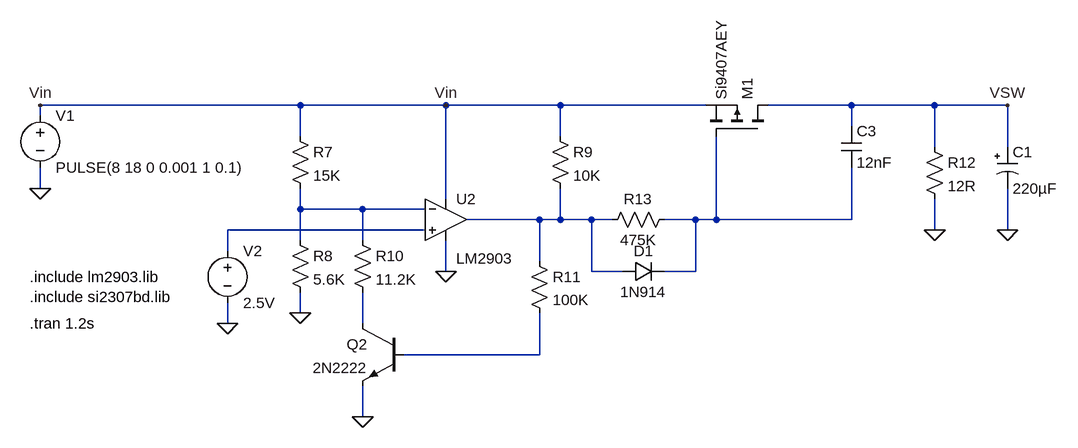
[diagram p0: schematic Power detection-1.asc]
Power detection-1.asc, the LTspice schematic file:
Version 4
SHEET 1 1060 1260
WIRE -432 608 -832 608
WIRE -208 608 -432 608
WIRE -32 608 -208 608
WIRE 192 608 -32 608
WIRE 416 608 288 608
WIRE 544 608 416 608
WIRE 656 608 544 608
WIRE -832 624 -832 608
WIRE 416 640 416 608
WIRE -432 656 -432 608
WIRE -32 656 -32 608
WIRE 544 672 544 608
WIRE 656 672 656 608
WIRE -832 736 -832 704
WIRE -208 752 -208 608
WIRE -432 768 -432 736
WIRE -336 768 -432 768
WIRE -240 768 -336 768
WIRE -64 784 -176 784
WIRE -32 784 -32 736
WIRE -32 784 -64 784
WIRE 16 784 -32 784
WIRE 48 784 16 784
WIRE 176 784 128 784
WIRE 208 784 208 656
WIRE 208 784 176 784
WIRE 416 784 416 704
WIRE 416 784 208 784
WIRE -240 800 -544 800
WIRE 544 800 544 752
WIRE 656 800 656 736
WIRE -432 816 -432 768
WIRE -336 816 -336 768
WIRE -544 832 -544 800
WIRE -64 848 -64 784
WIRE -208 864 -208 816
WIRE 16 864 16 784
WIRE 64 864 16 864
WIRE 176 864 176 784
WIRE 176 864 128 864
WIRE -432 928 -432 896
WIRE -544 944 -544 912
WIRE -336 944 -336 896
WIRE -64 992 -64 928
WIRE -64 992 -272 992
WIRE -336 1088 -336 1040
FLAG -832 736 0
FLAG -832 608 Vin
FLAG -208 864 0
FLAG -208 608 Vin
FLAG -432 928 0
FLAG -336 1088 0
FLAG 544 800 0
FLAG 656 800 0
FLAG 656 608 VSW
FLAG -544 944 0
SYMBOL voltage -832 608 R0
WINDOW 123 0 0 Left 0
WINDOW 39 0 0 Left 0
SYMATTR InstName V1
SYMATTR Value PULSE(8 18 0 0.001 1 0.1)
SYMBOL Opamps\\opamp2 -208 720 R0
WINDOW 3 16 96 Invisible 0
WINDOW 38 16 124 Left 0
SYMATTR Value ""
SYMATTR SpiceModel LM2903
SYMATTR InstName U2
SYMBOL res -448 640 R0
SYMATTR InstName R7
SYMATTR Value 15K
SYMBOL res -448 800 R0
SYMATTR InstName R8
SYMATTR Value 5.6K
SYMBOL res -48 640 R0
SYMATTR InstName R9
SYMATTR Value 10K
SYMBOL res -352 800 R0
SYMATTR InstName R10
SYMATTR Value 11.2K
SYMBOL res 528 656 R0
SYMATTR InstName R12
SYMATTR Value 12R
SYMBOL polcap 640 672 R0
WINDOW 3 24 64 Left 0
SYMATTR Value 220µF
SYMATTR InstName C1
SYMATTR Description Capacitor
SYMATTR Type cap
SYMATTR SpiceLine V=25 Irms=750m Rser=0.16 Lser=0
SYMBOL cap 400 640 R0
SYMATTR InstName C3
SYMATTR Value 12nF
SYMBOL npn -272 944 M0
SYMATTR InstName Q2
SYMATTR Value 2N2222
SYMBOL res -80 832 R0
SYMATTR InstName R11
SYMATTR Value 100K
SYMBOL res 144 768 R90
WINDOW 0 0 56 VBottom 0
WINDOW 3 32 56 VTop 0
SYMATTR InstName R13
SYMATTR Value 475K
SYMBOL voltage -544 816 R0
WINDOW 123 0 0 Left 0
WINDOW 39 0 0 Left 0
SYMATTR InstName V2
SYMATTR Value 2.5V
SYMBOL pmos 288 656 M270
SYMATTR InstName M1
SYMATTR Value Si9407AEY
SYMBOL diode 64 880 R270
WINDOW 0 32 32 VTop 0
WINDOW 3 0 32 VBottom 0
SYMATTR InstName D1
SYMATTR Value 1N914
TEXT -848 944 Left 0 !.tran 1.2s
TEXT -848 872 Left 0 !.include lm2903.lib\n.include si2307bd.lib

The netlist it stands for:
* Power detection-1.asc
V1 Vin 0 PULSE(8 18 0 0.001 1 0.1)
XU2 N004 N001 Vin 0 N002 LM2903  ; pins In+ In- V+ V- OUT
R7 Vin N001 15K
R8 N001 0 5.6K
R9 Vin N002 10K
R10 N001 N005 11.2K
R12 VSW 0 12R
C1 VSW 0 220µF V=25 Irms=750m Rser=0.16 Lser=0
C3 VSW N003 12nF
Q2 N005 N006 0 0 2N2222
R11 N002 N006 100K
R13 N003 N002 475K
V2 N004 0 2.5V
M1 VSW N003 Vin Vin Si9407AEY
D1 N002 N003 1N914
.model D D
.lib standard.dio
.model NPN NPN
.model PNP PNP
.lib standard.bjt
.model NMOS NMOS
.model PMOS PMOS
.lib standard.mos
.tran 1.2s
.include lm2903.lib
.include si2307bd.lib
.backanno
.end